# Altium schematic sheet Current Protection.SchDoc
size A3
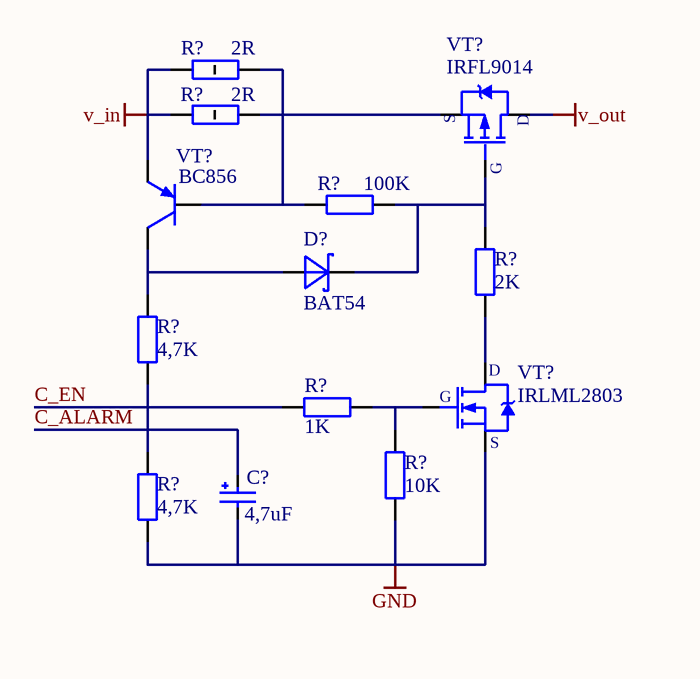
[diagram p0: Current Protection.SchDoc]

## Parts
(Parts that share a designator on the sheet are numbered #1, #2 ... from top to bottom, then left to right.)
C?  4,7uF  [5x11]
D?  BAT54  [SOT-23_N]
R?#1  value 2R  [Resistor 1W_m]  (hidden comment: Resistor 1W)
R?#2  value 2R  [Resistor 1W_m]  (hidden comment: Resistor 1W)
R?#3  value 100K  [R_1206]  (hidden comment: Resistor 1206)
R?#4  value 2K  [R_1206]  (hidden comment: Resistor 1206)
R?#5  value 4,7K  [R_1206]  (hidden comment: Resistor 1206)
R?#6  value 1K  [R_1206]  (hidden comment: Resistor 1206)
R?#7  value 10K  [R_1206]  (hidden comment: Resistor 1206)
R?#8  value 4,7K  [R_1206]  (hidden comment: Resistor 1206)
VT?#1  IRFL9014  [SOT-223_N]
VT?#2  BC856  [SOT-23_N]
VT?#3  IRLML2803  [SOT-23_N]

## Nets
GND: C?.2 R?#7.2 R?#8.1 VT?#3.3(S)
v_in: R?#1.1 R?#2.1 VT?#2.2(E)
v_out: VT?#1.2(D)
C_ALARM: C?.1 R?#5.1 R?#8.2
C_EN: R?#6.1
NetD?_1: D?.1(A) R?#5.2 VT?#2.3(C)
NetD?_3: D?.3(C) R?#3.1 R?#4.2 VT?#1.1(G)
NetR?#1_2: R?#1.2 R?#2.2 R?#3.2 VT?#1.3(S) VT?#2.1(B)
NetR?#4_1: R?#4.1 VT?#3.2(D)
NetR?#6_2: R?#6.2 R?#7.1 VT?#3.1(G)

## Library data of the parts
C? = Capacitor Polar
D? = BAT54: Diode Schottky
VT?#1 = IRFL9014: Power MOSFET P-channel
VT?#2 = BC856: PNP
VT?#3 = IRLML2803: Power MOSFET N-channel